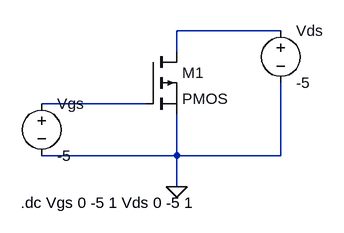
[diagram p0: schematic PMOS D&T.asc]
PMOS D&T.asc, the LTspice schematic file:
Version 4
SHEET 1 880 680
WIRE 368 80 208 80
WIRE 208 112 208 80
WIRE 160 192 0 192
WIRE 208 272 208 208
WIRE 208 272 0 272
WIRE 368 272 368 160
WIRE 368 272 208 272
WIRE 208 320 208 272
FLAG 208 320 0
SYMBOL pmos 160 112 R0
SYMATTR InstName M1
SYMBOL voltage 0 176 R0
WINDOW 123 0 0 Left 0
WINDOW 39 0 0 Left 0
SYMATTR InstName Vgs
SYMATTR Value -5
SYMBOL voltage 368 64 R0
WINDOW 123 0 0 Left 0
WINDOW 39 0 0 Left 0
SYMATTR InstName Vds
SYMATTR Value -5
TEXT -32 344 Left 2 !.dc Vgs 0 -5 1 Vds 0 -5 1

The netlist it stands for:
* PMOS D&T.asc
M1 N001 N002 0 0 PMOS
Vgs N002 0 -5
Vds N001 0 -5
.model NMOS NMOS
.model PMOS PMOS
.lib standard.mos
.dc Vgs 0 -5 1 Vds 0 -5 1
.backanno
.end